# Altium schematic sheet Stimulus_Feedback.SchDoc
size A; SheetNumber: 9; SheetTotal: 16
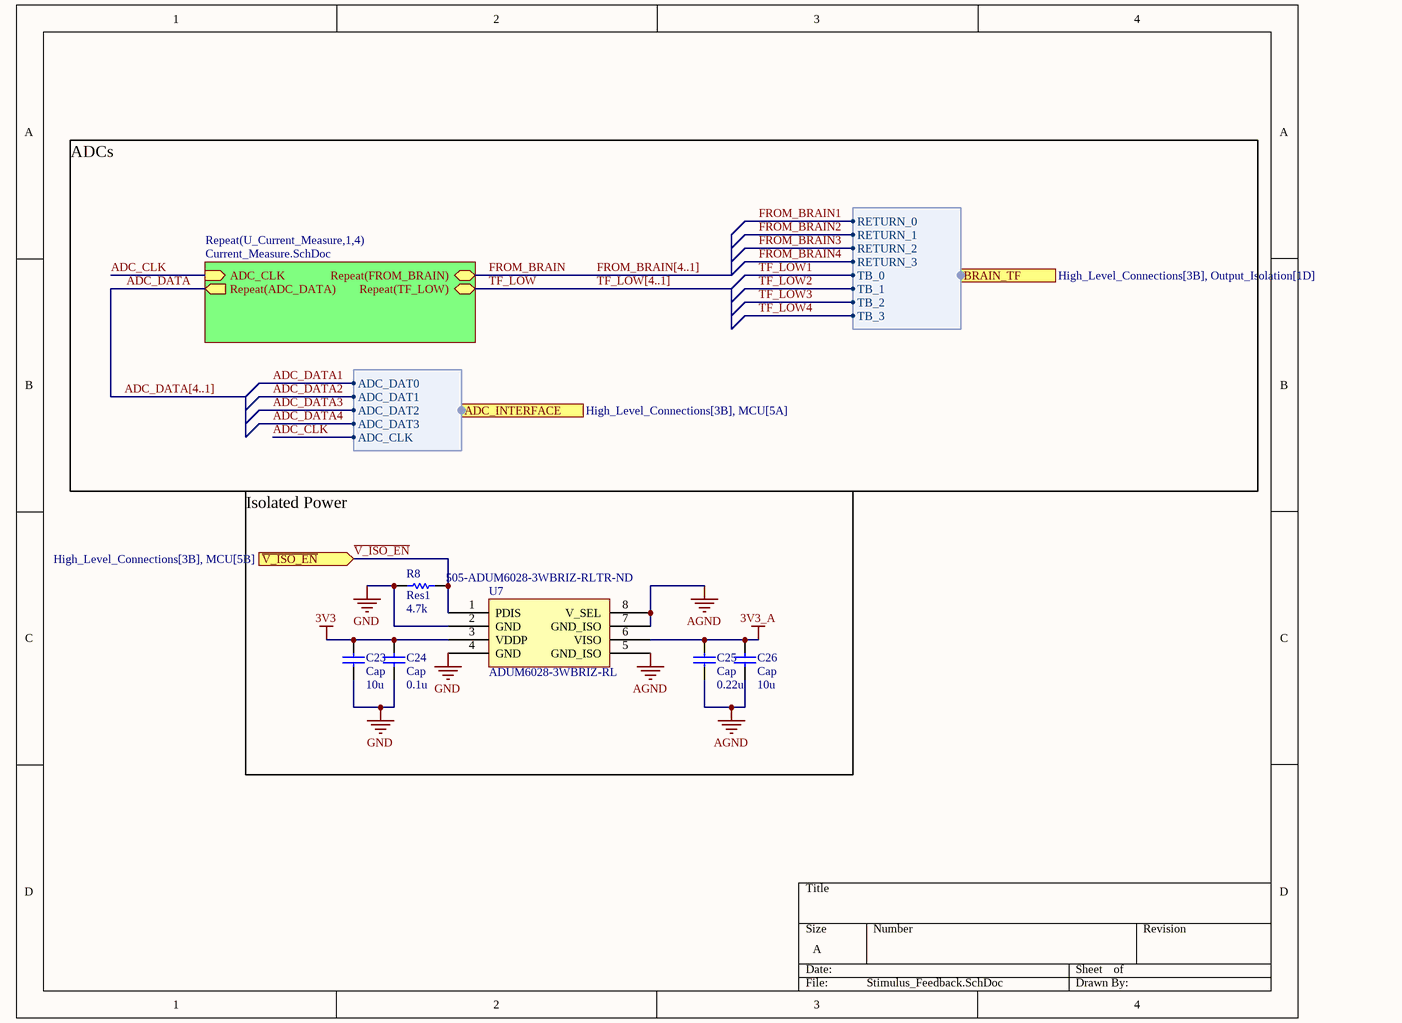
[diagram p0: Stimulus_Feedback.SchDoc]

## Parts
C23  Cap  value 10u  [CAPC1608X05N]
C24  Cap  value 0.1u  [CAPC1608X05N]
C25  Cap  value 0.22u  [CAPC1608X05N]
C26  Cap  value 10u  [CAPC1608X05N]
R8  Res1  value 4.7k  [0402_Res]
U7  ADUM6028-3WBRIZ-RL  Supplier Part Number 1: 505-ADUM6028-3WBRIZ-RLTR-ND  [ADUM6028-3WBRIZ-RL]

## Blocks framed on the sheet
Isolated Power: C23-C26 R8 U7

## Sub-sheets
Repeat(U_Current_Measure,1,4) = Current_Measure.SchDoc: ADC_CLK (in), Repeat(ADC_DATA) (out), Repeat(FROM_BRAIN) (bidir), Repeat(TF_LOW) (bidir)

## Ports
ADC_INTERFACE (harness ADC_DATA, see High_Level_Connections[3B], MCU[5A]), BRAIN_TF (harness Brain_Trans_Conn, see High_Level_Connections[3B], Output_Isolation[1D]), ~{V_ISO_EN} (in, see High_Level_Connections[3B], MCU[5B])

## Harnesses
Brain_Trans_Conn: RETURN_0, RETURN_1, RETURN_2, RETURN_3, TB_0, TB_1, TB_2, TB_3
ADC_DATA: ADC_DAT0, ADC_DAT1, ADC_DAT2, ADC_DAT3, ADC_CLK

## Nets
3V3: C23.2 C24.2 U7.3(VDDP)
3V3_A: C25.2 C26.2 U7.6(VISO)
AGND: C25.1 C26.1 U7.5(GND_ISO) U7.7(GND_ISO) U7.8(V_SEL)
GND: C23.1 C24.1 R8.1 U7.2(GND) U7.4(GND)
~{V_ISO_EN}: R8.2 U7.1(PDIS) ; port ~{V_ISO_EN}
ADC_CLK: sheet Repeat(U_Current_Measure,1,4)/ADC_CLK, port ADC_INTERFACE.ADC_CLK
ADC_DATA: sheet Repeat(U_Current_Measure,1,4)/Repeat(ADC_DATA)
ADC_DATA1: port ADC_INTERFACE.ADC_DAT0
ADC_DATA2: port ADC_INTERFACE.ADC_DAT1
ADC_DATA3: port ADC_INTERFACE.ADC_DAT2
ADC_DATA4: port ADC_INTERFACE.ADC_DAT3
FROM_BRAIN: sheet Repeat(U_Current_Measure,1,4)/Repeat(FROM_BRAIN)
FROM_BRAIN1: port BRAIN_TF.RETURN_0
FROM_BRAIN2: port BRAIN_TF.RETURN_1
FROM_BRAIN3: port BRAIN_TF.RETURN_2
FROM_BRAIN4: port BRAIN_TF.RETURN_3
TF_LOW: sheet Repeat(U_Current_Measure,1,4)/Repeat(TF_LOW)
TF_LOW1: port BRAIN_TF.TB_0
TF_LOW2: port BRAIN_TF.TB_1
TF_LOW3: port BRAIN_TF.TB_2
TF_LOW4: port BRAIN_TF.TB_3

## Buses and harness runs
bus ADC_DATA[4..1]
bus FROM_BRAIN[4..1]
bus TF_LOW[4..1]

## Notes on the sheet
- ADCs

## Library data of the parts
C23-C26 = Cap: Capacitor; Published: 8-Jun-2000; LatestRevisionDate: 17-Jul-2002; LatestRevisionNote: Re-released for DXP Platform.; PackageReference: RAD-0.3; Publisher: Altium Limited; PackageDescription: Radial Cap, Thru-Hole; 2 Leads; 0.3 in Pin Spacing
R8 = Res1: Resistor; Published: 8-Jun-2000; LatestRevisionDate: 17-Jul-2002; LatestRevisionNote: Re-released for DXP Platform.; PackageReference: AXIAL-0.3; Publisher: Altium Limited; PackageDescription: Axial Device, Thru-Hole; 2 Leads; 0.3 in Pin Spacing
U7 = ADUM6028-3WBRIZ-RL: Supplier 1: DigiKey